# EAGLE schematic 50x50element (EAGLE 7.6.0)
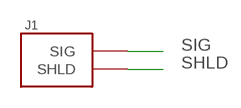
[diagram p0: schematic, sheet 1]

## Parts
J1  SMA-SMT-  [0732511352]

## Nets
SHLD: J1.SHLD1(SHLD) J1.SHLD2(SHLD) J1.SHLD3(SHLD) J1.SHLD4(SHLD)
SIG: J1.SIG

## Library data of the parts
J1 = myLib:SMA; MFG: molex; MPN: 0732511352